# EAGLE schematic AlphaNumeric-Display-Driver (EAGLE 5.04)
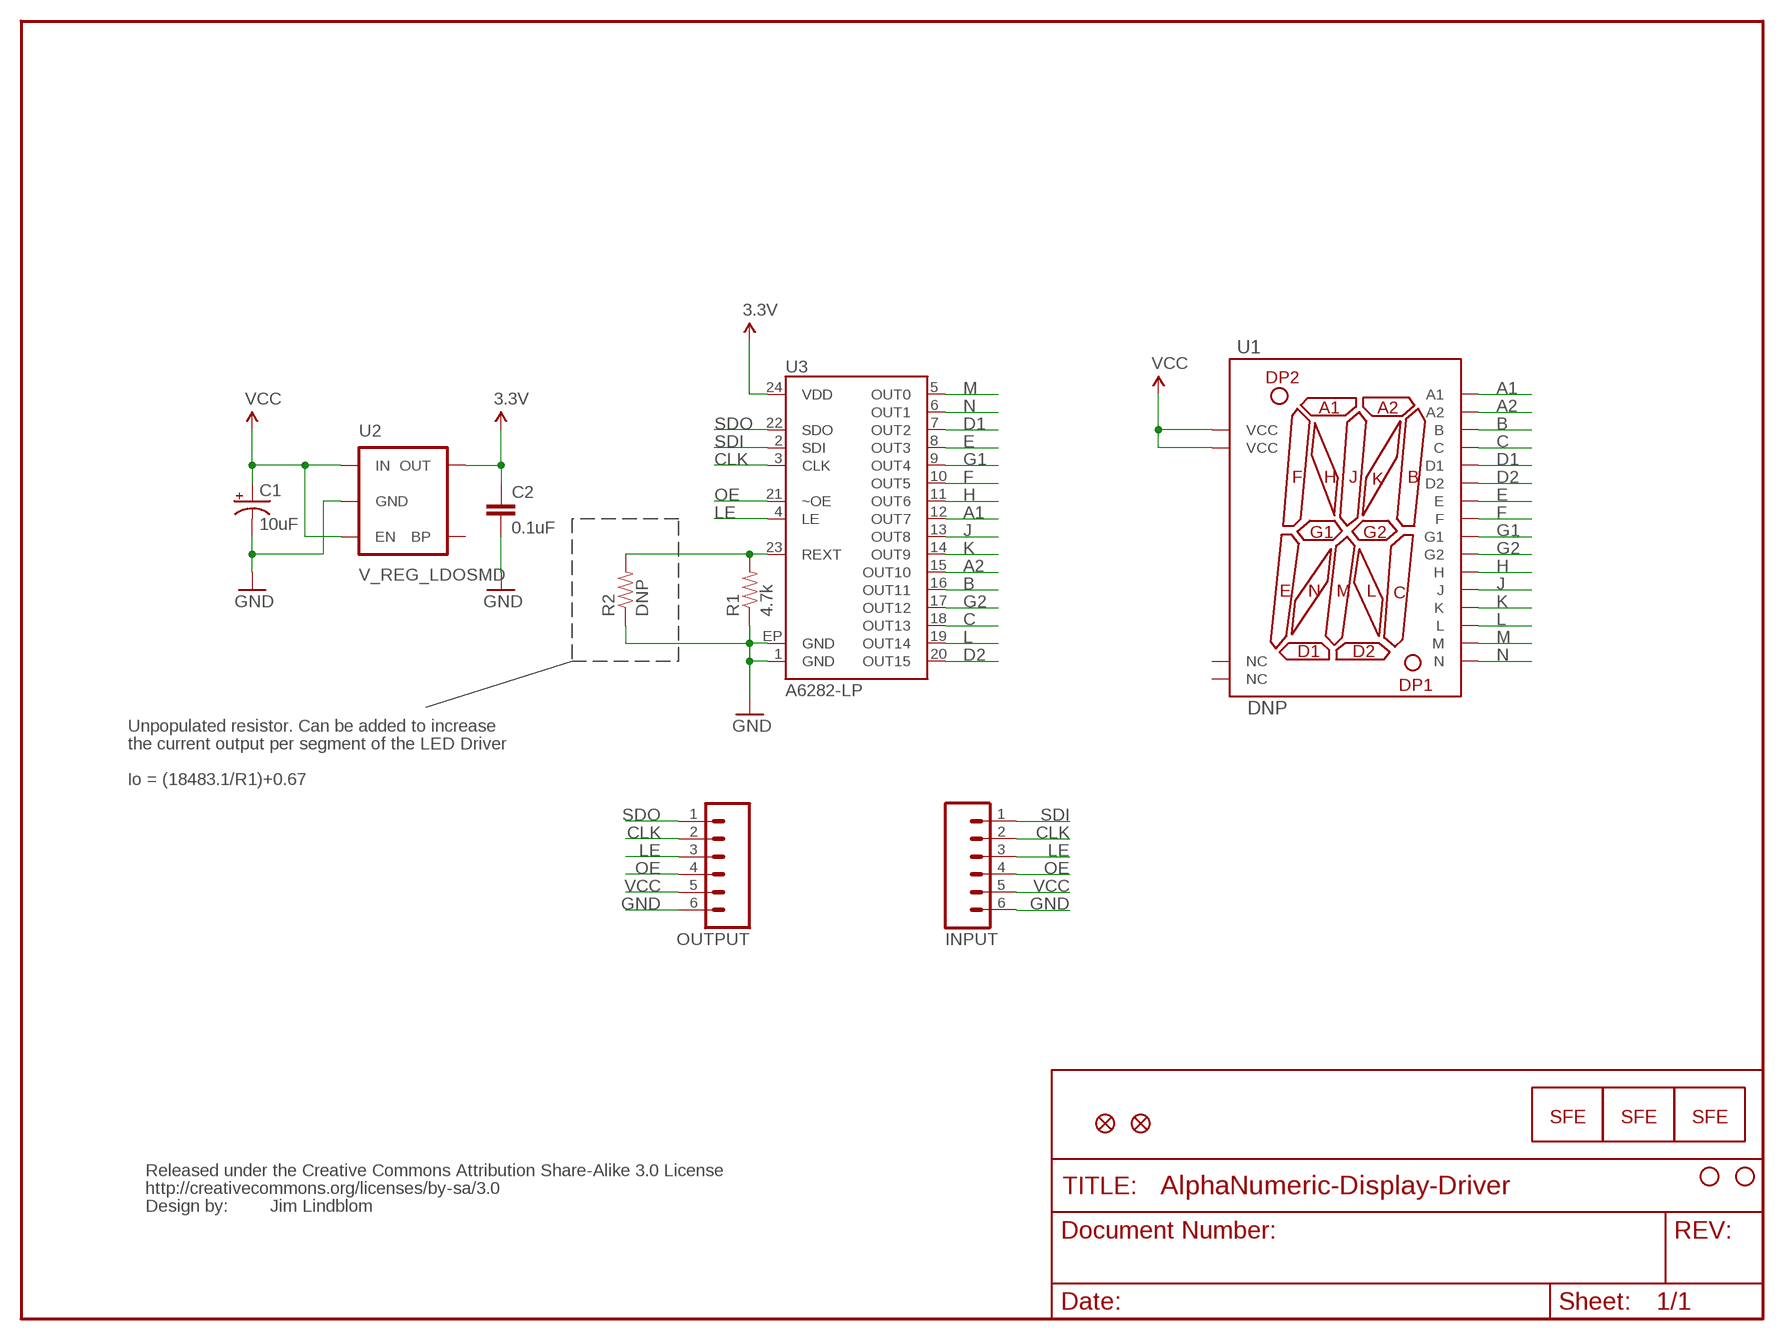
[diagram p0: schematic, sheet 1]

## Parts
C1  10uF  CAP_POL1206  [EIA3216]
C2  0.1uF  CAP0402-CAP  [0402-CAP]
INPUT  M06SMD-FEMALE-V2  [1X06-SMD-FEMALE-V2]
JP1  LOGO-SFESK  [SFE-LOGO-FLAME]
JP2  STAND-OFF  [STAND-OFF]
JP3  STAND-OFF  [STAND-OFF]
JP4  LOGO-SFENW2  [SFE-NEW-WEB]
JP5  LOGO-SFESK  [SFE-LOGO-FLAME]
JP6  FIDUCIAL1X2  [FIDUCIAL-1X2]
JP7  FIDUCIAL1X2  [FIDUCIAL-1X2]
OUTPUT  M06SMD  [1X06-SMD]
R1  4.7k  RESISTOR0402-RES  [0402-RES]
R2  DNP  RESISTORPTH-1/6W  [1/6W-RES]
U1  DNP  ALPHANUMERICPTH  [ALPHANUMERIC]
U2  V_REG_LDOSMD  [SOT23-5]
U3  A6282-LP  [TSSOP-24]
U$1  CREATIVE_COMMONS  [CREATIVE_COMMONS]

## Nets
3.3V: C2.1 U2.5(OUT) U3.24(VDD)
A1: U1.2(A1) U3.12(OUT7)
A2: U1.22(A2) U3.15(OUT10)
B: U1.21(B) U3.16(OUT11)
C: U1.16(C) U3.18(OUT13)
CLK: INPUT.2 OUTPUT.2 U3.3(CLK)
D1: U1.10(D1) U3.7(OUT2)
D2: U1.14(D2) U3.20(OUT15)
E: U1.9(E) U3.8(OUT3)
F: U1.4(F) U3.10(OUT5)
G1: U1.7(G1) U3.9(OUT4)
G2: U1.19(G2) U3.17(OUT12)
GND: C1.C(-) C2.2 INPUT.6 OUTPUT.6 R1.1 R2.1 U2.2(GND) U3.1(GND) U3.EP(GND)
H: U1.3(H) U3.11(OUT6)
J: U1.24(J) U3.13(OUT8)
K: U1.23(K) U3.14(OUT9)
L: U1.15(L) U3.19(OUT14)
LE: INPUT.3 OUTPUT.3 U3.4(LE)
M: U1.12(M) U3.5(OUT0)
N: U1.11(N) U3.6(OUT1)
OE: INPUT.4 OUTPUT.4 U3.21(~OE)
REXT: R1.2 R2.2 U3.23(REXT)
SDI: INPUT.1 U3.2(SDI)
SDO: OUTPUT.1 U3.22(SDO)
VCC: C1.A(+) INPUT.5 OUTPUT.5 U1.6(VCC) U1.18(VCC) U2.1(IN) U2.3(EN)
Unconnected: U1.1(NC) U1.13(NC) U2.4(BP)

## Notes on the sheet
- Unpopulated resistor. Can be added to increase
- the current output per segment of the LED Driver
- Io = (18483.1/R1)+0.67
- Jim Lindblom

## Library data of the parts
C1 = SparkFun:CAP_POL: Capacitor Polarized These are standard SMD and PTH capacitors. Normally 10uF, 47uF, and 100uF in electrolytic and tantalum varieties. Always verify the external diameter of the through hole cap, it varies with capacity, voltage, and manufacturer. The EIA devices should be standard.
C2 = SparkFun:CAP: Capacitor Standard 0603 ceramic capacitor, and 0.1" leaded capacitor.
INPUT OUTPUT = SparkFun:M06: Header 6 Standard 6-pin 0.1" header. Use with straight break away headers (SKU : PRT-00116), right angle break away headers (PRT-00553), swiss pins (PRT-00743), machine pins (PRT-00117), and female headers (PRT-00115). Molex polarized connector foot print use with SKU : PRT-08094 with associated crimp pins and housings. NOTES ON THE VARIANTS LOCK and LOCK_LONGPADS... This footprint was designed to help hold the alignment of a through-hole component (i.e. 6-pin header) while soldering it into place. You may notice that each hole has been shifted either up or down by 0.005 of an inch from it's more standard position (which is a perfectly straight line). This slight alteration caused the pins (the squares in the middle) to touch the edges of the holes. Because they are alternating, it causes a "brace" to hold the component in place. 0.005 has proven to be the perfect amount of "off-center" position when using our standard breakaway headers. Although looks a little odd when you look at the bare footprint, once you have a header in there, the alteration is very hard to notice. Also, if you push a header all the way into place, it is covered up entirely on the bottom side. This idea of altering the position of holes to aid alignment will be further integrated into the Sparkfun Library for other footprints. It can help hold any component with 3 or more connection pins.
JP1 JP4 JP5 = SparkFun:LOGO-SFE: Spark Fun Electronics PCB Logo This is the standard Spark Fun Electronics PCB logo.
JP2 JP3 = SparkFun:STAND-OFF: Stand Off This is the mechanical footprint for a #4 phillips button head screw. Use the keepout ring to avoid running the screw head into surrounding components. SKU : PRT-00447
JP6 JP7 = SparkFun:FIDUCIAL: Fiducial Alignment Points Various fiducial points for machine vision alignment.
R1 R2 = SparkFun:RESISTOR: Resistor Basic schematic elements and footprints for 0603, 1206, and PTH resistors.
U1 = SparkFun:ALPHANUMERIC
U2 = SparkFun:V_REG_LDO: Voltage Regulator LDO Standard 150mA LDO voltage regulator in SOT-23 layout. Micrel part MIC5205. BP (by-pass) pin is used to lower output noise with 470pF cap.
U3 = SparkFun:A6282: Allegro A6282 16-Channel Constant-Current LED Driver Packages: TSSOP-24, 24-pin QFN Last modified: 8/20/10 Unproven!
U$1 = SparkFun:CREATIVE_COMMONS